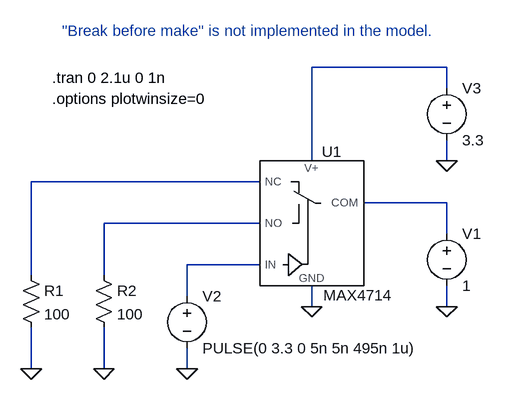
[diagram p0: schematic MAX4714_test.asc]
MAX4714_test.asc, the LTspice schematic file:
Version 4
SHEET 1 880 680
WIRE 528 -48 320 -48
WIRE 528 -16 528 -48
WIRE 320 96 320 -48
WIRE 528 96 528 64
WIRE 240 128 -112 128
WIRE 528 160 400 160
WIRE 240 192 0 192
WIRE 528 208 528 160
WIRE 240 256 128 256
WIRE -112 272 -112 128
WIRE 0 272 0 192
WIRE 128 304 128 256
WIRE 320 320 320 288
WIRE 528 320 528 288
WIRE -112 416 -112 352
WIRE 0 416 0 352
WIRE 128 416 128 384
FLAG 320 320 0
FLAG 528 320 0
FLAG 128 416 0
FLAG 0 416 0
FLAG -112 416 0
FLAG 528 96 0
SYMBOL MAX4714 320 192 R0
SYMATTR InstName U1
SYMBOL res -128 256 R0
SYMATTR InstName R1
SYMATTR Value 100
SYMBOL res -16 256 R0
SYMATTR InstName R2
SYMATTR Value 100
SYMBOL voltage 528 192 R0
SYMATTR InstName V1
SYMATTR Value 1
SYMBOL voltage 128 288 R0
WINDOW 123 0 0 Left 0
WINDOW 39 0 0 Left 0
SYMATTR InstName V2
SYMATTR Value PULSE(0 3.3 0 5n 5n 495n 1u)
SYMBOL voltage 528 -32 R0
SYMATTR InstName V3
SYMATTR Value 3.3
TEXT -80 -32 Left 0 !.tran 0 2.1u 0 1n
TEXT -80 0 Left 0 !.options plotwinsize=0
TEXT -64 -104 Left 0 ;"Break before make" is not implemented in the model.

The netlist it stands for:
* MAX4714_test.asc
XU1 N005 N001 0 N002 N003 N004 MAX4714.FAM MAX4714 MAX4714  ; pins IN V+ GND NC COM NO
R1 N002 0 100
R2 N004 0 100
V1 N003 0 1
V2 N005 0 PULSE(0 3.3 0 5n 5n 495n 1u)
V3 N001 0 3.3
.tran 0 2.1u 0 1n
.options plotwinsize=0
* "Break before make" is not implemented in the model.
.backanno
.end